# EAGLE design SirenaNextionNRF52 (EAGLE 9.6.2)
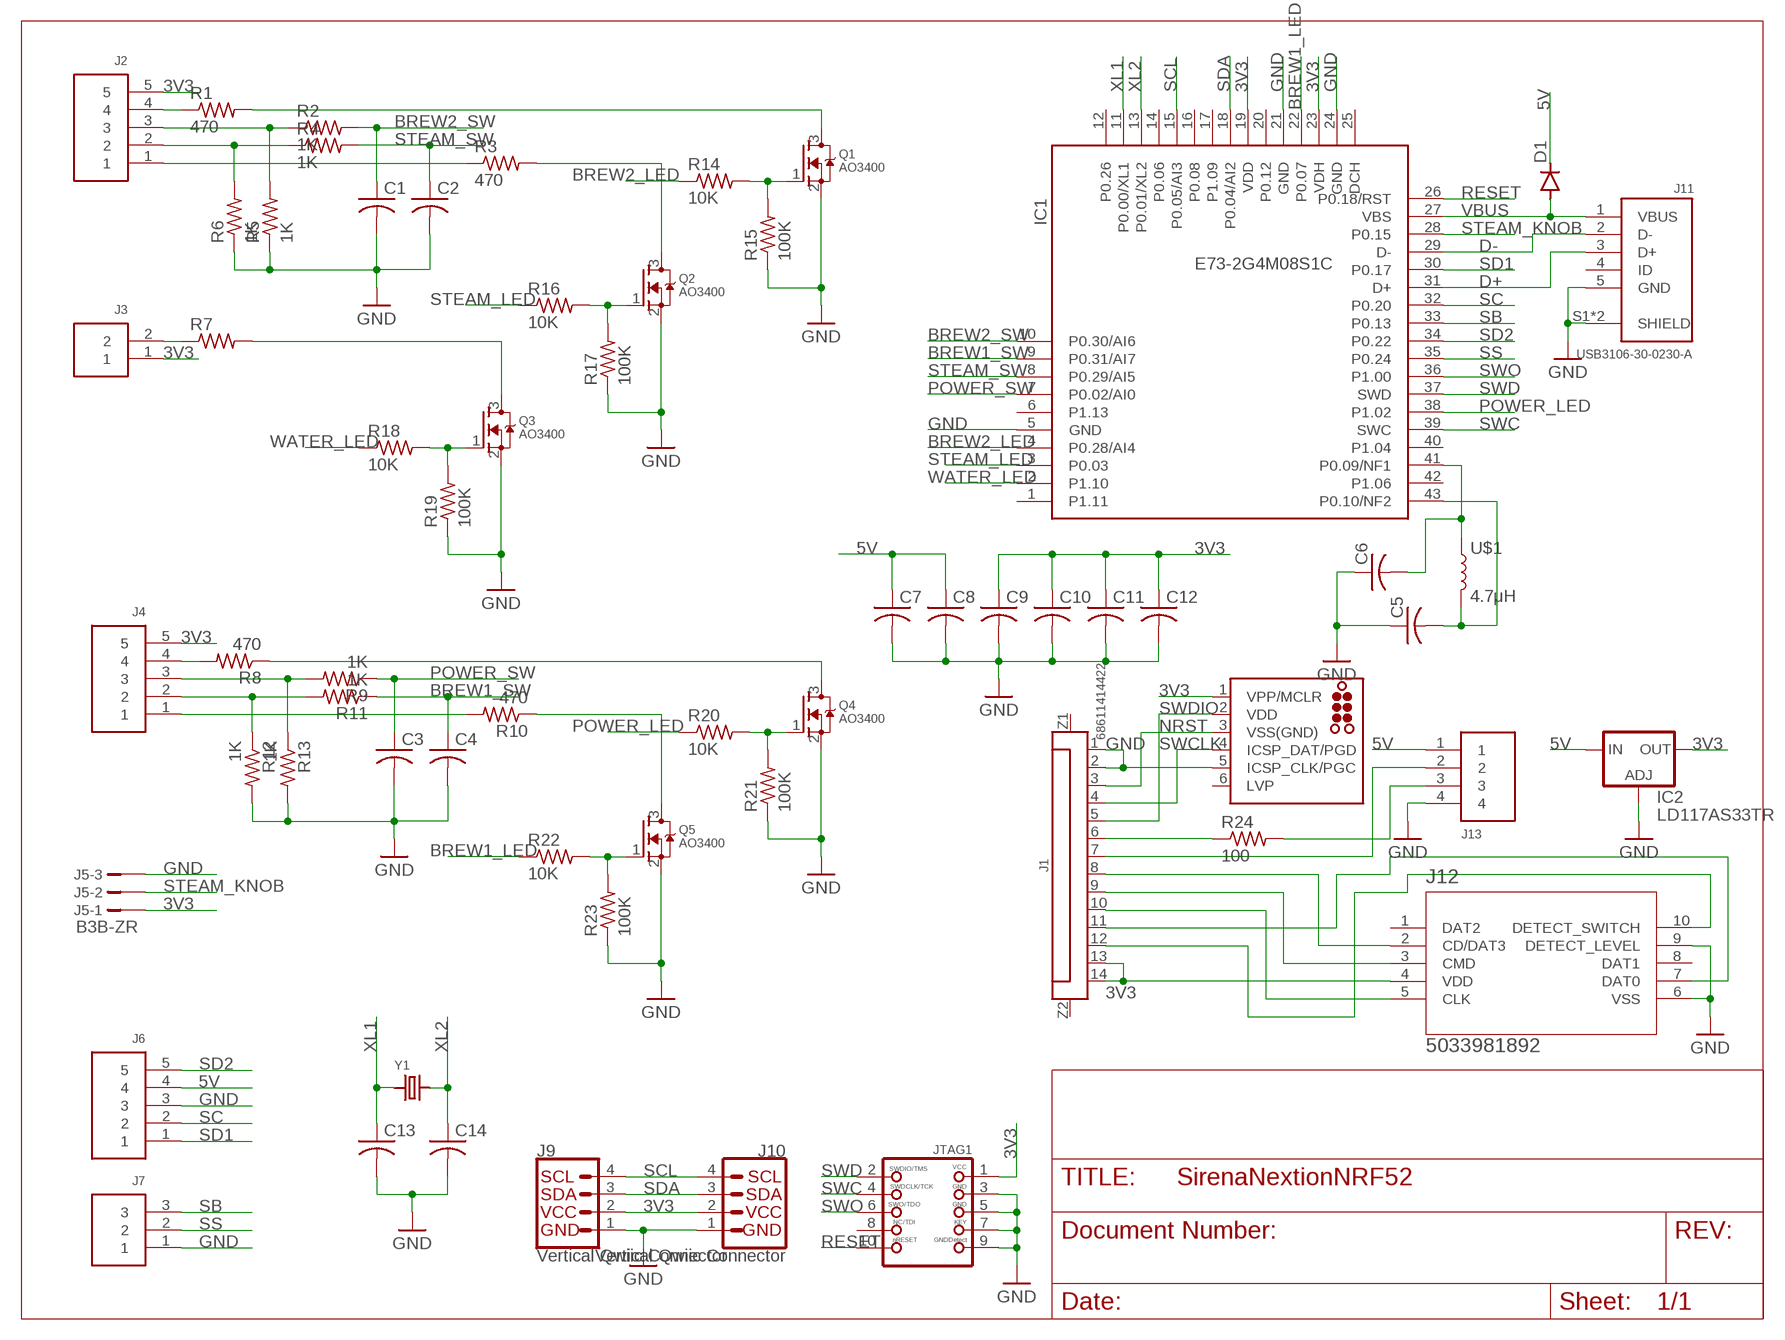
[diagram p0: schematic, sheet 1]

## Parts
C1  C-USC0603  [C0603]
C2  C-USC0603  [C0603]
C3  C-USC0603  [C0603]
C4  C-USC0603  [C0603]
C5  C-USC0603  [C0603]
C6  C-USC0603  [C0603]
C7  C-USC0603  [C0603]
C8  C-USC0603  [C0603]
C9  C-USC0603  [C0603]
C10  C-USC0603  [C0603]
C11  C-USC0603  [C0603]
C12  C-USC0603  [C0603]
C13  C-USC0603  [C0603]
C14  C-USC0603  [C0603]
D1  DIODE-SOD323-R  [SOD323-R]
IC1  E73-2G4M08S1C  [SMD]
IC2  LD117AS33TR  [SOT223]
J1  68611414422  6861XX14422_68611414422  [68611414422]
J2  5PINB5B-PH-SM4-TB  [B5B-PH-SM4-TB]
J3  2PINB2B-PH-SM4-TB  [B2B-PH-SM4-TB]
J4  5PINB5B-PH-SM4-TB  [B5B-PH-SM4-TB]
J5  B3B-ZR  [B3B-ZR]
J6  5PINB5B-PH-SM4-TB  [B5B-PH-SM4-TB]
J7  3PINB3B-PH-SM4-TB  [B3B-PH-SM4-TB]
J9  Vertical Qwiic Connector  QWIIC_CONNECTOR  [JST04_1MM_VERT]
J10  Vertical Qwiic Connector  QWIIC_CONNECTOR  [JST04_1MM_VERT]
J11  USB3106-30-0230-A  [USB3106-30-0230-A]
J12  5033981892  [503398-1892_MOL]
J13  4PIN  [B4B-XH-K-S]
J14  TC2030-MCP-NL  [TC2030-MCP-NL]
JTAG1  JTAG-CORTEXM3  [2X05_1.27MM_SMT]
Q1  AO3400  MOSFET-NREFLOW  [SOT23]
Q2  AO3400  MOSFET-NREFLOW  [SOT23]
Q3  AO3400  MOSFET-NREFLOW  [SOT23]
Q4  AO3400  MOSFET-NREFLOW  [SOT23]
Q5  AO3400  MOSFET-NREFLOW  [SOT23]
R1  470  R-US_R0603  [R0603]
R2  1K  R-US_R0603  [R0603]
R3  470  R-US_R0603  [R0603]
R4  1K  R-US_R0603  [R0603]
R5  1K  R-US_R0603  [R0603]
R6  1K  R-US_R0603  [R0603]
R7  R-US_R0603  [R0603]
R8  470  R-US_R0603  [R0603]
R9  1K  R-US_R0603  [R0603]
R10  470  R-US_R0603  [R0603]
R11  1K  R-US_R0603  [R0603]
R12  1K  R-US_R0603  [R0603]
R13  1K  R-US_R0603  [R0603]
R14  10K  R-US_R0603  [R0603]
R15  100K  R-US_R0603  [R0603]
R16  10K  R-US_R0603  [R0603]
R17  100K  R-US_R0603  [R0603]
R18  10K  R-US_R0603  [R0603]
R19  100K  R-US_R0603  [R0603]
R20  10K  R-US_R0603  [R0603]
R21  100K  R-US_R0603  [R0603]
R22  10K  R-US_R0603  [R0603]
R23  100K  R-US_R0603  [R0603]
R24  100  R-US_R0603  [R0603]
U$1  4.7μH  RFID_ANTENNA_W3102  [W3102]
Y1  CRYSTAL8X3.8SMT  [CRYSTAL_8X3.8]

## Nets
3V3: C9.1 C10.1 C11.1 C12.1 IC1.19(VDD) IC1.23(VDH) IC2.4(OUT) J1.13 J1.14 J2.5 J3.1 J4.5 J5.1 J9.2 J10.2 J12.4(VDD) J14.1(VPP/MCLR) JTAG1.1
5V: C7.1 C8.1 D1.C IC2.3(IN) J6.4 J13.1
BREW1_LED: IC1.22(P0.07) R22.1
BREW1_SW: C4.1 IC1.9(P0.31/AI7) R11.1
BREW2_LED: IC1.4(P0.28/AI4) R14.1
BREW2_SW: C1.1 IC1.10(P0.30/AI6) R2.2
D+: IC1.31(D+) J11.3(D+)
D-: IC1.29(D-) J11.2(D-)
GND: C1.2 C2.2 C3.2 C4.2 C5.1 C6.1 C7.2 C8.2 C9.2 C10.2 C11.2 C12.2 C13.2 C14.2 IC1.5(GND) IC1.21(GND) IC1.24(GND) IC2.1(ADJ) J1.1 J1.2 J5.3 J6.3 J7.1 J9.1 J10.1 J11.5(GND) J11.S1(SHIELD) J11.S2(SHIELD) J12.6(VSS) J12.9(DETECT_LEVEL) J13.4 J14.5(ICSP_CLK/PGC) JTAG1.3 JTAG1.5 JTAG1.7 JTAG1.9 Q1.2(S) Q2.2(S) Q3.2(S) Q4.2(S) Q5.2(S) R5.1 R6.1 R12.2 R13.2 R15.1 R17.1 R19.1 R21.1 R23.1
N$1: J3.2 R7.1
N$2: Q2.3(D) R3.2
N$4: J2.4 R1.1
N$5: J4.1 R10.2
N$6: J2.3 R2.1 R5.2
N$7: J2.2 R4.1 R6.2
N$8: Q1.3(D) R1.2
N$9: J1.8 J12.2(CD/DAT3)
N$10: J1.6 R24.1
N$11: C6.2 IC1.41(P0.09/NF1) U$1.1
N$12: Q2.1(G) R16.2 R17.2
N$13: Q1.1(G) R14.2 R15.2
N$14: C5.2 IC1.43(P0.10/NF2) U$1.2
N$16: Q3.3(D) R7.2
N$17: Q3.1(G) R18.2 R19.2
N$19: J4.4 R8.2
N$20: J4.3 R9.2 R13.1
N$21: J2.1 R3.1
N$22: J4.2 R11.2 R12.1
N$23: Q4.3(D) R8.1
N$24: Q5.3(D) R10.1
N$25: J13.3 R24.2
N$26: J1.7 J13.2
N$27: Q4.1(G) R20.2 R21.2
N$28: Q5.1(G) R22.2 R23.2
N$29: J1.9 J12.3(CMD)
N$30: J1.10 J12.5(CLK)
N$31: J1.11 J12.7(DAT0)
N$32: J1.12 J12.10(DETECT_SWITCH)
NRST: J1.3 J14.3(VSS(GND))
POWER_LED: IC1.38(P1.02) R20.1
POWER_SW: C3.1 IC1.7(P0.02/AI0) R9.1
RESET: IC1.26(P0.18/RST) JTAG1.10
SB: IC1.33(P0.13) J7.3
SC: IC1.32(P0.20) J6.2
SCL: IC1.15(P0.05/AI3) J9.4 J10.4
SD1: IC1.30(P0.17) J6.1
SD2: IC1.34(P0.22) J6.5
SDA: IC1.18(P0.04/AI2) J9.3 J10.3
SS: IC1.35(P0.24) J7.2
STEAM_KNOB: IC1.28(P0.15) J5.2
STEAM_LED: IC1.3(P0.03) R16.1
STEAM_SW: C2.1 IC1.8(P0.29/AI5) R4.2
SWC: IC1.39(SWC) JTAG1.4
SWCLK: J1.4 J14.4(ICSP_DAT/PGD)
SWD: IC1.37(SWD) JTAG1.2
SWDIO: J1.5 J14.2(VDD)
SWO: IC1.36(P1.00) JTAG1.6
VBUS: D1.A IC1.27(VBS) J11.1(VBUS)
WATER_LED: IC1.2(P1.10) R18.1
XL1: C13.1 IC1.11(P0.00/XL1) Y1.P$1
XL2: C14.1 IC1.13(P0.01/XL2) Y1.P$4
Unconnected: IC1.1(P1.11) IC1.6(P1.13) IC1.12(P0.26) IC1.14(P0.06) IC1.16(P0.08) IC1.17(P1.09) IC1.20(P0.12) IC1.25(DCH) IC1.40(P1.04) IC1.42(P1.06) J1.Z1 J1.Z2 J11.4(ID) J12.1(DAT2) J12.8(DAT1) J14.6(LVP) JTAG1.8

## Library data of the parts
C1-C14 = rcl:C-US: CAPACITOR, American symbol; SPICEPREFIX: C
D1 = diode:DIODE-: DIODE
IC1 = ebyte_E73:E73-2G4M08S1C: nRF52840 2.4GHz SMD Wireless Module
IC2 = v-reg:LD117A?*: Low drop fixed and adjustable positive voltage regulators 1 A Source: http://www.st.com/stonline/products/literature/ds/7194/ld1117axx.pdf
J1 = Wurth_Connectors_WR-FPC:6861XX14422_68611414422: WR-FPC 1.00 mm SMT ZIF Horizontal Bottom Contact KIND PROPERTIES Pitch 1 mm MATERIAL PROPERTIES Insulator Material PPS Contact Material Phosphor Bronze Contact Plating 100 (µ") Tin over 50 (µ") Nickel Contact Type Stamped <https://www.we-online.com/catalog/media/o33099v209%20Family_WR-FPC_68611214422.jpg> Details see: https://www.we-online.com/catalog/en/FPC_1_00_SMT_ZIF_HORIZONTAL_BOTTOM_CONTACT_6861XX14422/ Updated by Ella Wu 2021-07-19 2021(C) Wurth Elektronik; CONTACT-RESISTANCE: 20mOhm; DATASHEET-URL: https://www.we-online.com/catalog/datasheet/68611414422.pdf; IR: 1A; L: 21mm; MATE-WITH: WR-FFC 1.00 mm Flat Flexible Cable Type 1 (Contacts on same side)/ Type 2 (Contacts opposite); PACKAGING: Tape and Reel; PART-NUMBER: 68611414422; PINS: 14; PITCH: 1mm; TYPE: Horizontal; WORKING-VOLTAGE: 125V(AC)
J2 J4 J6 = jst_eph:5PIN
J3 = jst_eph:2PIN
J5 = con-jst (2):?3B-ZR: ZH CONNECTOR 1.5 mm, 3 pin 1 row Source: http://www.jst.com .. eZH.pdf
J7 = jst_eph:3PIN
J9 J10 = SparkFun-Connectors:QWIIC_CONNECTOR: SparkFun I2C Standard Qwiic Connector An SMD 1mm pitch JST connector makes it easy and quick (get it? Qwiic?) to connect I2C devices to each other. The Qwiic system <http://www.sparkfun.com/qwiic> enables fast and solderless connection between popular platforms and various sensors and actuators. We carry 200mm <https://www.sparkfun.com/products/14204>, 100mm <https://www.sparkfun.com/products/14205>, 50mm <https://www.sparkfun.com/products/14206>, and breadboard friendly <https://www.sparkfun.com/products/14207> Qwiic cables. We also offer 10 pcs strips <https://www.sparkfun.com/products/14323> the SMD connectors.; PROD_ID: CONN-14483
J11 = USB connector:USB3106-30-0230-A: MICRO A/B SKT, VERTICAL, TH, 30" Manufacturer's datasheet <https://gct.co/files/drawings/usb3106.pdf>; CREATED_BY: PCBLayout.com; DIGIKEY_PARTNO: 2073-USB3106-30-0230-ATR-ND; MANUFACTURER: GCT; MPN: USB3106-30-0230-A
J12 = discrete:5033981892: MOLEX 503398-1892 MEMORY CARD SOCKET; COPYRIGHT: Copyright (C) 2022 Ultra Librarian. All rights reserved.; MANUFACTURER_PART_NUMBER: 5033981892; MFR_NAME: Molex Connector Corporation
J13 = jst_exh:4PIN
J14 = tag-connect:TC2030: TAG-CONNECT ICSP Connector Manufacturer: Tag-Connect <http://www.tag-connect.com> Cable for easy In-Circuit Serial Programming. Designed for Microchip ICD2, suitable for many others. Two variants - one "with legs" (for hands-free fit on PCB) and another "without legs" for quick programming. PAD Description 1 MCLR/Vpp 2 Vdd 3 GND 4 PGD (ISPDAT) 5 PGC (ISPCLK) 6 nc (used for LVP) ©2009 ROFA.cz - modified and updated by Robert Darlington ‹rdarlington@gmail.com›
JTAG1 = microbuilder:JTAG-CORTEXM3: Serial Wire (SW-DP) Connector This standard 0.05" 10-pin connector is for use with the Cortex M0/M3's native SWD (serial wire debugger) interface (SW-DP). Some boards support a 20-pin combined JTAG+SWD connector (SWJ-DP), such as the LPC1700 family, but many smaller devices only work with SWD which typically use the smaller 10-pin SW-DP connecter (the LPC1300 family, for example, only supports SWD). 2x05 1.27mm/0.05" Connector: This is the standard SMT connector defined by ARM for all Cortex devices, and should be used in most situations and for forward-compatibility since any new devices coming to market will likely use this connector. MOLEX 10 Pin 0.1" Connector: This 0.1" 10 pin connector has the same pin layout as the standard 0.05" connector, but is easier to work with if you are using standard jumper wires or custom cables to connect your SWD hardware. MOLEX 20 Pin 0.1" Connector: This 0.1" 20 pin connector is the same model used for ARM7/ARM9 JTAG debuggers, but is connected to match the pins on the Segger J-Link for ARM (which supports both JTAG and SWD debugging). See the following document from ARM for more information on Cortex M3 Debug Connectors: http://infocenter.arm.com/help/topic/com.arm.doc.faqs/attached/13634/cortex_debug_connectors.pdf And the following page for an overview with images of the different connector types: http://www.keil.com/peripherals/coresight/connectors.asp
Q1-Q5 = adafruit:MOSFET-N: N-Channel Mosfet 2N7002E - 60V 260mA SOT23 [Digikey: 2N7002ET1GOSTR-ND] - REEL BSH103 - 30V 850mA SOT23 [Digikey: 568-5013-1-ND]
R1-R24 = rcl:R-US_: RESISTOR, American symbol; SPICEPREFIX: R
U$1 = SparkFun-RF:RFID_ANTENNA_W3102: W3102 Pulse Larsen NFC / RFID SMD Antenna 13.56MHz 4.7μH; PROD_ID: ANT-16333
Y1 = microbuilder:CRYSTAL: Crystals HC49UP - Surface Mount Crystal 4.0MHz 18pF +/-30ppm Surface Mount Crystal [Digikey: 535-9857-1-ND] 12.0 MHz Surface Mount Crystal [Digikey: 535-9869-6-ND] 25.0 MHz Surface Mount Crystal [Digikey: 535-9078-1-ND] 2.5 x 2.0mm - MEMs SMT Crystal 16.0 MHz 10pF 20ppm 2.5 x 2.0mm Crystal [Digikey -40-85°C: 535-10923-1-ND] 3.2 x 2.5mm - MEMs SMT Crystal 12.0 MHz 8pF 15ppm 3.2 x 2.5mm Crystal [Digikey: -10-70°C: 644-1047-1-ND -40-125°C: 644-1128-1-ND] 16.0 MHz 8pF 15ppm 3.2 x 2.5mm Crystal [Digikey: -10-70°C: 644-1049-1-ND -40-125°C: 644-1129-2-ND] 16.0 MHz 10pF 10ppm 3.2 x 2.5mm Crystal [Digikey: 644-1100-1-ND] 27.12 MHz 18pF 30ppm 3.2 x 2.5mm Crystal [Digikey: 887-1424-1-ND] 27.12MHz 10pF 10ppm 3.2 x 2.5mm Crystal [Digikey: 887-1329-1-ND] 4.9 x 1.8mm - MEMs SMT Crystal 32.768 KHz 12.5pF 20ppm 4.9 x 1.8mm Crystal [Digikey: SE2415CT-ND] 8.0 x 3.8mm - Surface Mount Crystal 32.768kHz 12.5pF 20ppm -40°C-85°C [Digikey: 535-9166-2-ND] Cylinder 32.768KHz Cylinder Crystal (2x6mm body) [Ex. Digikey: 300-8341-2-ND]

## Board
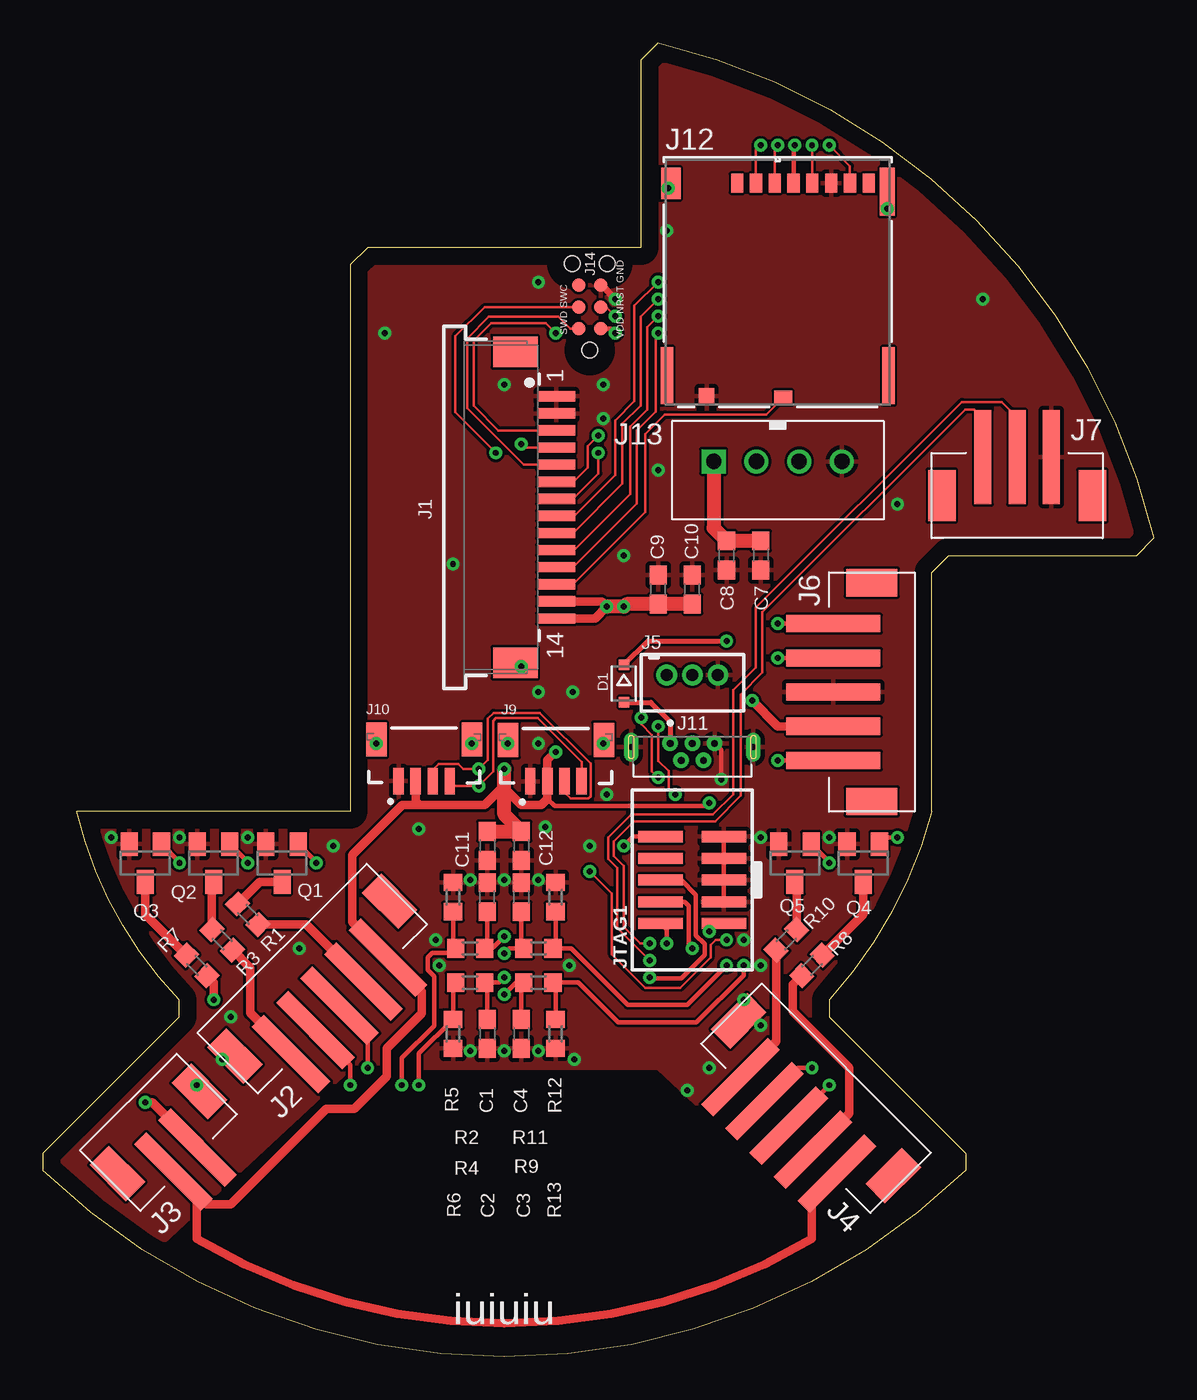
[diagram p1: board, top side]
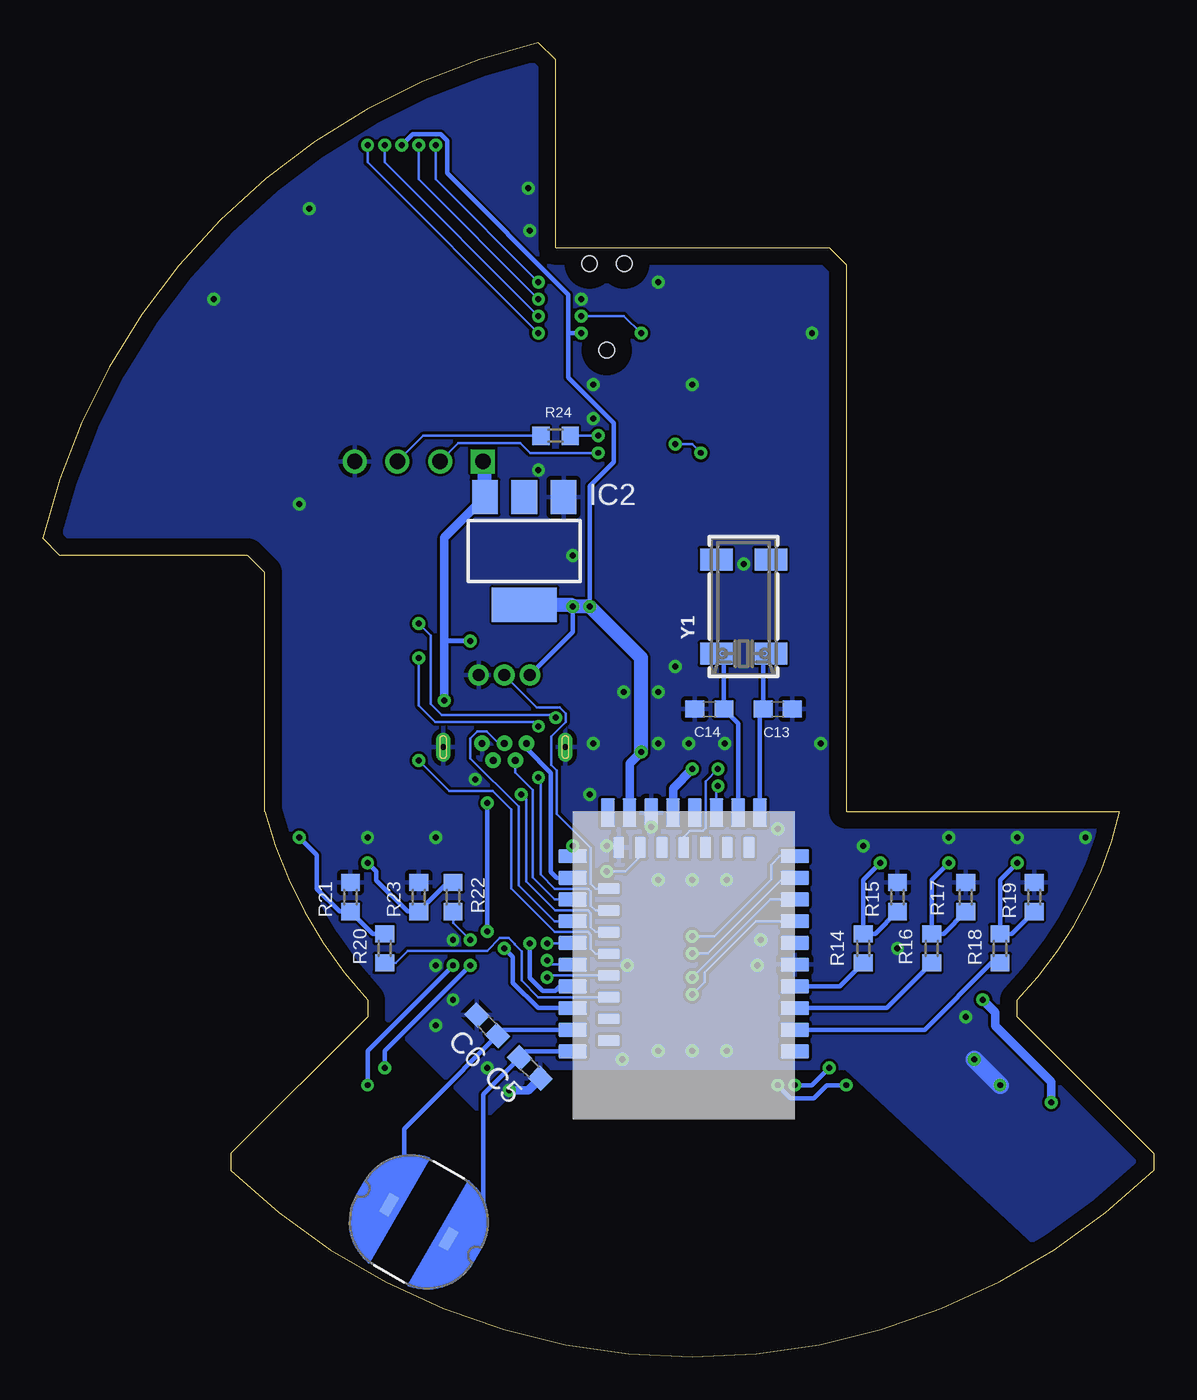
[diagram p2: board, bottom side, seen from below]

Size 65 x 76.9 mm. Coordinates in mm from the lower left corner, seen from the top.
Outline: 35,64.9 35,75.9 36,76.9 arc-63 65,47.9 64,46.9 53,46.9 52,45.9 52,31.9 arc-28 46,20.9 46,19.9 54,11.9 54,10.9 arc-88 0,10.9 0,11.9 8,19.9 8,20.9 arc-31 2,31.9 18,31.9 18,63.9 19,64.9 35,64.9
Copper layers (1*16): Top 0.035mm / dielectric 1.5mm / Bottom 0.035mm
Design rules "default *": minimum track width 6mil, minimum drill 0.35mm, track to track 6mil, track to pad 6mil, pad to pad 6mil, via to via 6mil, smd to smd 6mil, copper to edge 40mil, drill to drill 6mil, minimum pad ring 10mil, minimum via ring 8mil, stop-mask expansion 2mil, vias tented up to drill 100mil, thermal gap 10mil

### Footprints (pad centres in the part's own frame; a part is rotated, then mirrored left to right if it is on the bottom)
C0603 = smd 1.1 x 1: 1 -0.85,0; 2 0.85,0
SOD323-R = smd 0.6 x 0.6: A 1.1,0; C -1.1,0
SMD = smd 1.676 x 0.813: 1 13,3.97; 2 13,5.24; 3 13,6.51; 4 13,7.78; 5 13,9.05; 6 13,10.32; 7 13,11.59; 8 13,12.86; 9 13,14.13; 10 13,15.4; 26 0,15.4; 27 0,14.13; 29 0,12.86; 31 0,11.59; 33 0,10.32; 35 0,9.05; 37 0,7.78; 39 0,6.51; 41 0,5.24; 43 0,3.97 | smd 0.813 x 1.676: 11 10.95,17.94; 13 9.68,17.94; 15 8.41,17.94; 17 7.14,17.94; 19 5.87,17.94; 21 4.6,17.94; 23 3.33,17.94; 25 2.06,17.94 | smd 0.635 x 1.27: 12 10.31,15.9; 14 9.04,15.9; 16 7.77,15.9; 18 6.5,15.9; 20 5.23,15.9; 22 3.96,15.9; 24 2.69,15.9 | smd 1.27 x 0.635: 28 2.1,13.495; 30 2.1,12.225; 32 2.1,10.955; 34 2.1,9.685; 36 2.1,8.415; 38 2.1,7.145; 40 2.1,5.875; 42 2.1,4.605
SOT223 = smd 1.5 x 2: 1 -2.3,-3.15; 2 0,-3.15; 3 2.3,-3.15 | smd 3.8 x 2: 4 0,3.15
68611414422 = smd 0.6 x 2.2: 1 -6.5,3.8; 2 -5.5,3.8; 3 -4.5,3.8; 4 -3.5,3.8; 5 -2.5,3.8; 6 -1.5,3.8; 7 -0.5,3.8; 8 0.5,3.8; 9 1.5,3.8; 10 2.5,3.8; 11 3.5,3.8; 12 4.5,3.8; 13 5.5,3.8; 14 6.5,3.8 | smd 1.8 x 2.6: Z1 -9.1,1.4; Z2 9.1,1.4
B5B-PH-SM4-TB = smd 1 x 5.5: 1 -4,-4.75; 2 -2,-4.75; 3 0,-4.75; 4 2,-4.75; 5 4,-4.75 | smd 1.6 x 3: P1 -6.4,-2.5; P2 6.4,-2.5
B2B-PH-SM4-TB = smd 1 x 5.5: 1 -1,-4.75; 2 1,-4.75 | smd 1.6 x 3: P1 -3.4,-2.5; P2 3.4,-2.5
B3B-ZR = drill 0.7 pad 1.1: 1 -1.5,0; 2 0,0; 3 1.5,0
B3B-PH-SM4-TB = smd 1 x 5.5: 1 -2,-4.75; 2 0,-4.75; 3 2,-4.75 | smd 1.6 x 3: P1 -4.4,-2.5; P2 4.4,-2.5
JST04_1MM_VERT = smd 0.6 x 1.55: 1 -1.478,0.775; 2 -0.478,0.775; 3 0.522,0.775; 4 1.522,0.775 | smd 1.2 x 2: NC1 -2.778,3.2; NC2 2.822,3.2
USB3106-30-0230-A = drill 0.4: 1 -1.3,0; 2 -0.65,-1; 3 0,0; 4 0.65,-1; 5 1.3,0 | drill 0.35 long: S1 -3.575,-0.22; S2 3.575,-0.22
503398-1892_MOL = smd 0.711 x 1.092: 1 -2.38,5.776; 2 -1.28,5.776; 3 -0.18,5.776; 4 0.92,5.776; 5 2.02,5.776; 6 3.12,5.776; 7 4.22,5.776; 8 5.32,5.776 | smd 0.889 x 0.94: 9 -4.17,-6.689 | smd 1.041 x 0.787: 10 0.31,-6.764 | smd 1.143 x 1.829: 11 -6.26,5.761 | smd 0.864 x 2.794: 12 6.4,5.276 | smd 0.711 x 3.327: 13 -6.48,-5.489; 14 6.48,-5.489
B4B-XH-K-S = drill 0.9 square: 1 3.75,0 | drill 0.9: 2 1.25,0; 3 -1.25,0; 4 -3.75,0
TC2030-MCP-NL = smd 0.787 x 0.787: 1 1.27,-0.635; 2 1.27,0.635; 3 2.54,-0.635; 4 2.54,0.635; 5 3.81,-0.635; 6 3.81,0.635 | hole 0.889: 0,0; 5.08,-1.016; 5.08,1.016
2X05_1.27MM_SMT = smd 0.65 x 2.6: 1 -2.54,-1.85; 2 -2.54,1.85; 3 -1.27,-1.85; 4 -1.27,1.85; 5 0,-1.85; 6 0,1.85; 7 1.27,-1.85; 8 1.27,1.85; 9 2.54,-1.85; 10 2.54,1.85
SOT23 = smd 1 x 1.4: 1 -0.95,-1.1; 2 0.95,-1.1; 3 0,1.1
R0603 = smd 1 x 1.1: 1 -0.85,0; 2 0.85,0
W3102 = smd 1.27 x 0.635: 1 0,2; 2 0,-2
CRYSTAL_8X3.8 = smd 1.3 x 1.9: P$1 -2.75,-1.6; P$2 2.75,-1.6; P$3 2.75,1.6; P$4 -2.75,1.6

### Placement (x,y rotation side)
C1  26,26.9 90 top
C2  26,18.9 270 top
C3  28,18.9 270 top
C4  28,26.9 90 top
C5  36.5,16.9 135 bottom
C6  39,19.4 315 bottom
C7  42,46.9 270 top
C8  40,46.9 270 top
C9  36,44.9 90 top
C10  38,44.9 90 top
C11  26,29.9 270 top
C12  28,29.9 270 top
C13  22,37.9 0 bottom
C14  26,37.9 180 bottom
D1  34,39.4 270 top
IC1  34,13.9 0 bottom
IC2  36.83,47.16 180 bottom
J1  26.25,49.71 270 top
J2  14,23.9 45 top
J3  5,14.9 45 top
J4  47,16.9 315 top
J5  38,39.9 0 top
J6  51,38.9 270 top
J7  57,47.9 180 top
J9  30,32.9 0 top
J10  22.29,32.92 0 top
J11  38,35.9 0 top
J12  43,62.9 0 top
J13  43,52.4 180 top
J14  32,58.9 90 top
JTAG1  38,27.9 90 top
Q1  14,28.9 180 top
Q2  10,28.9 180 top
Q3  6,28.9 180 top
Q4  48,28.9 180 top
Q5  44,28.9 180 top
R1  12,25.9 135 top
R2  25,23.9 0 top
R3  10.5,24.4 135 top
R4  25,21.9 0 top
R5  24,26.9 270 top
R6  24,18.9 90 top
R7  9,22.9 135 top
R8  45,22.9 225 top
R9  29,21.9 0 top
R10  43.5,24.4 225 top
R11  29,23.9 0 top
R12  30,26.9 90 top
R13  30,18.9 270 top
R14  17,23.9 90 bottom
R15  15,26.9 270 bottom
R16  13,23.9 90 bottom
R17  11,26.9 270 bottom
R18  9,23.9 90 bottom
R19  7,26.9 270 bottom
R20  45,23.9 90 bottom
R21  47,26.9 270 bottom
R22  41,26.9 90 bottom
R23  43,26.9 270 bottom
R24  35,53.9 180 bottom
U$1  43,7.9 60 bottom
Y1  24,43.9 90 bottom

### Tracks (layer width: path | path; a pad name or v marks a point on that pad's centre or on a via)
3V3  (via drill 0.35)
  Top 0.254: J12.4 43.92,70.82 v44,70.9 | v39,24.9 39.46,25.36 JTAG1.1 | v39,32.4 38.84,32.24 29.94,32.24 29.52,32.66 | J14.1 33.23,60.17 v33.5,59.9
  Top 0.508: J10.2 21.81,32.51 22.04,32.28 | 22.04,32.28 25.85,32.28 27,33.44 v27,34.4 27,33.29 28.01,32.28 29.15,32.28 29.52,32.66 J9.2 29.52,34.92 v30,35.4 | J1.13 32.69,44.21 v33,43.9 32.31,43.21 J1.14 | J3.1 9,9.48 | 9,9.48 9,6.9 arc61 45,6.9 45,9.24 J4.5 | 9,9.48 9.57,8.91 10.99,8.91 16.57,14.5 18.23,14.5 20.13,16.41 20.13,18.06 22.16,20.09 22.16,21.39 J2.5 18.1,25.46 18.1,29.36 21.02,32.28 22.04,32.28
  Top 0.813: v33,43.9 v34,43.9 34.15,44.05 C9.1 C10.1 | C11.1 C12.1 27,31.75 v27,34.4
  Bottom 0.254: v33,43.9 33,50.96 31.59,52.37 31.59,54.63 34.26,57.3 34.26,59.84 | 34.26,59.84 34.26,62.17 41.34,69.26 41.34,71.17 41.73,71.56 43.34,71.56 v44,70.9 | J5.1 34,42.4 v34,43.9 | v39,32.4 v39,24.9 | v33.5,59.9 34.2,59.9 34.26,59.84
  Bottom 0.508: IC1.19 28.13,33.27 v27,34.4 | IC1.23 30.67,34.73 v30,35.4
  Bottom 0.813: IC2.4 34.11,44.01 v34,43.9 v33,43.9 30,40.9 v30,35.4
5V  (via drill 0.35)
  Top 0.305: D1.C 35.4,41.9 v40,41.9
  Top 0.508: J6.4 43,36.9 v41.5,38.4
  Top 0.813: C7.1 C8.1 39.25,48.5 J13.1
  Bottom 0.305: v40,41.9 41.46,41.9 41.5,41.93
  Bottom 0.508: v41.5,38.4 41.5,41.93 41.5,47.94 IC2.3
  Bottom 0.813: IC2.3 39.13,52.28 J13.1
BREW1_LED  (via drill 0.35)
  Top 0.152: v32,28.4 33.29,27.11 33.29,23.55 35.25,21.59 37.3,21.59 39.07,23.36 39.07,24.1 39.37,24.4 v40,24.4
  Bottom 0.152: R22.1 41,25.4 v40,24.4 | IC1.22 30.04,29.29 30.93,28.4 v32,28.4
BREW1_SW  (via drill 0.35)
  Top 0.254: C4.1 28,24.05 R11.1 27.3,23.9 v27,23.6
  Bottom 0.152: IC1.9 21.68,28.03 26.11,23.6 v27,23.6
BREW2_LED
  Bottom 0.254: IC1.4 18.37,21.68 R14.1
BREW2_SW  (via drill 0.35)
  Top 0.254: C1.1 26,24.05 R2.2 25.85,23.96 26.37,23.96 v27,24.6
  Bottom 0.152: v27,24.6 25.73,24.6 22.4,27.93 22.4,28.79 21.89,29.3 IC1.10
D+
  Bottom 0.152: J11.3 38.34,35.9 39.02,36.58 39.58,36.58 39.98,36.18 39.98,35.01 37.16,32.19 37.16,27.6 35.05,25.49 IC1.31
D-
  Bottom 0.152: J11.2 37.35,34.19 36.33,33.17 36.33,28.04 35.05,26.76 IC1.29
GND  (via drill 0.35)
  Top 0.254: JTAG1.3 JTAG1.5 JTAG1.7 JTAG1.9 | J11.5 39.7,35.5 v39.7,33.8
  Top 0.406: J14.5 32.69,62.71 v33.5,61.9
  Bottom 0.508: C5.1 36.6,15.6 v37.7,15.6
  Bottom 1.016: v9,15.9 v10.5,17.4
  other vias: 12,30.4 8,30.4 4,30.4 42,30.4 46,30.4 25,17.9 27,17.9 29,17.9 25,27.9 27,27.9 29,27.9 15,23.9 11,19.9 41,20.9 39,16.9 28,40.4 36.6,68.4 49.4,67.2 31.1,17.4 23,24.4 17,29.9 22,30.9 19.5,35.9 25.1,35.9 27.2,35.9 32.8,35.9 42,19.4 32.8,56.9 34,46.9 50,49.9 29,35.9 33,32.9 20,59.9 29,38.9 31,38.9 29.4,31 27,56.9 24,46.4 55,61.9 42,22.9 23.2,22.9 30.8,22.9 41,24.4 32,29.9 29,62.9 36.5,65.9 32.8,54.9 36,51.9
  pour Top: 4,3.9 18,16.9 36,16.9 39.11,14.01 66,40.9 66,57.9 46,77.9 8,77.9 -12,57.9 -12,19.9
  pour Bottom: 4,3.9 18,16.9 36,16.9 39.11,14.01 66,40.9 66,57.9 46,77.9 8,77.9 -12,57.9 -12,19.9
N$1  (via drill 0.35)
  Top 0.508: v10,20.9 10,21.9 R7.1 | J3.2 6.41,14.9 v6,14.9
  Bottom 0.508: v6,14.9 6,16.1 9.27,19.37 9.27,20.17 v10,20.9
N$2
  Top 0.508: R3.2 9.9,27.7 Q2.3
N$4
  Top 0.508: R1.1 15.43,25.3 J2.4
N$5
  Top 0.508: R10.2 42.9,18.45 J4.1
N$6  (via drill 0.35)
  Top 0.254: R5.2 24,24.05 R2.1 23.9,23.64 22.8,23.64 22.51,23.36 22.51,22.63 22.89,22.25 22.89,19.37 21,17.48 v21,15.9 | v19,16.9 19,18.9 J2.3
  Bottom 0.254: v19,16.9 20,15.9 v21,15.9
N$7  (via drill 0.35)
  Top 0.254: R4.1 24,21.75 R6.2 22,17.75 v22,15.9 | v18,15.9 18,17.07 J2.2
  Bottom 0.254: v22,15.9 21.24,15.14 19.91,15.14 19.14,15.9 v18,15.9
N$8
  Top 0.508: R1.2 12.7,27.8 Q1.3
N$9  (via drill 0.35)
  Top 0.152: v36,62.9 34.6,61.5 34.6,55.91 33.48,54.79 33.48,51.6 31.09,49.21 J1.8 | J12.2 41.72,70.62 v42,70.9
  Bottom 0.152: v36,62.9 42,68.9 v42,70.9
N$10  (via drill 0.35)
  Top 0.152: J1.6 31.05,51.21 31.89,52.05 31.89,53.29 v32.5,53.9
  Bottom 0.152: v32.5,53.9 R24.1
N$11
  Bottom 0.254: IC1.41 38.06,19.14 C6.2 42.33,14.86 43.84,13.35 43.84,9.79 U$1.1
N$12  (via drill 0.35)
  Top 0.254: Q2.1 12,28.95 v12,28.9
  Bottom 0.254: v12,28.9 13,27.9 R16.2 12.3,24.75 R17.2
N$13  (via drill 0.35)
  Top 0.254: Q1.1 16,28.95 v16,28.9
  Bottom 0.254: v16,28.9 17,27.9 R14.2 16.3,24.75 R15.2
N$14
  Bottom 0.254: IC1.43 36.73,17.87 C5.2 39.24,15.36 39.24,8.93 U$1.2
N$16
  Top 0.508: Q3.3 6,25.9 R7.2
N$17  (via drill 0.35)
  Top 0.254: Q3.1 8,28.95 v8,28.9
  Bottom 0.254: v8,28.9 9,27.9 R18.2 8.3,24.75 R19.2
N$19
  Top 0.508: R8.2 43.88,21.78 43.88,20.22 47.18,16.92 47.18,14.25 J4.4
N$20  (via drill 0.35)
  Top 0.254: R13.1 30,21.75 R9.2 31.33,21.9 33.66,19.56 38.23,19.56 41,22.33 v41,22.9 | J4.3 v46,15.9
  Bottom 0.254: v46,15.9 46,17.9 v41,22.9
N$21
  Top 0.508: J2.1 12.13,20.11 12.13,22.77 R3.1
N$22  (via drill 0.35)
  Top 0.254: R12.1 30,24.05 R11.2 30.92,23.9 34.21,20.6 37.71,20.6 v40,22.9 | J4.2 44.17,16.9 v45,16.9
  Bottom 0.254: v45,16.9 45,17.9 v40,22.9
N$23
  Top 0.508: R8.1 48,25.9 Q4.3
N$24
  Top 0.508: R10.1 44.1,27.7 Q5.3
N$25
  Bottom 0.152: R24.2 42.75,53.9 J13.3
N$26  (via drill 0.35)
  Top 0.152: J1.7 31.02,50.21 32.5,51.69 v32.5,52.9
  Bottom 0.152: v32.5,52.9 36.49,52.9 37.05,53.46 40.69,53.46 J13.2
N$27  (via drill 0.35)
  Top 0.254: Q4.1 49.35,30.4 v50,30.4
  Bottom 0.254: v50,30.4 48.97,29.37 48.97,27.39 47.63,26.05 R21.2 45.7,24.75 R20.2
N$28  (via drill 0.35)
  Top 0.254: Q5.1 46,28.95 v46,28.9
  Bottom 0.254: R22.2 41.3,27.75 R23.2 43.66,26.05 45.49,27.88 45.49,28.39 v46,28.9
N$29  (via drill 0.35)
  Top 0.152: J1.9 31.03,48.21 33.91,51.09 33.91,54.6 34.98,55.67 34.98,60.88 v36,61.9 | J12.3 42.82,70.72 v43,70.9
  Bottom 0.152: v36,61.9 43,68.9 v43,70.9
N$30  (via drill 0.35)
  Top 0.152: J1.10 31.09,47.21 34.35,50.47 34.35,54.43 35.37,55.44 35.37,60.26 v36,60.9 | J12.5 45.02,70.88 v45,70.9
  Bottom 0.152: v36,60.9 45,69.9 v45,70.9
N$31  (via drill 0.35)
  Top 0.152: J1.11 31.03,46.21 34.75,49.93 34.75,54.2 35.87,55.33 35.87,59.77 v36,59.9 | J12.7 47.22,69.68 v46,70.9
  Bottom 0.152: v36,59.9 46,69.9 v46,70.9
N$32
  Top 0.152: J1.12 31.03,45.21 35.24,49.42 35.24,54 36.39,55.14 42.32,55.14 J12.10
NRST  (via drill 0.35)
  Top 0.152: v33.5,60.9 32.96,61.44 J14.3 | J1.3 26.65,54.21 25.21,55.65 25.21,59.46 26.23,60.48 29.42,60.48 v30,59.9
  Bottom 0.152: v30,59.9 31,60.9 v33.5,60.9
POWER_LED
  Bottom 0.152: IC1.38 36,21.04 36.98,22.02 36.98,23.73 37.39,24.14 37.39,24.15 37.75,24.5 38.25,24.5 39,23.76 43.65,23.76 44.36,23.05 R20.1
POWER_SW  (via drill 0.35)
  Top 0.254: C3.1 28,21.75 R9.1 27.7,21.9 v27,21.2
  Bottom 0.152: v27,21.2 26.27,21.92 26.27,22.49 23.28,25.49 IC1.7
RESET  (via drill 0.35)
  Top 0.254: JTAG1.10 34.54,30.44 v34,29.9
  Bottom 0.254: IC1.26 v34,29.9
SB  (via drill 0.35)
  Top 0.152: v35.5,24.2 34.95,24.2 33.98,25.17 33.98,28.72 33.39,29.31 33.39,30.15 34.58,31.34 39.33,31.34 40.83,32.84 40.83,38.76 42.1,40.03 42.1,43.59 53.96,55.44 54.49,55.44 55,54.93 J7.3
  Bottom 0.152: v35.5,24.2 34.02,24.2 IC1.33
SC  (via drill 0.35)
  Top 0.152: v37,32.9 36.61,33.29 36.61,34.27 36,34.87 v36,36.9
  Top 0.254: v43,40.9 J6.2
  Bottom 0.152: v43,40.9 43,38.11 42.05,37.16 36.26,37.16 v36,36.9 | IC1.32 32.66,24.85 32.93,25.12 32.93,25.95 33.1,26.12 35.02,26.12 36.73,27.83 36.73,32.63 v37,32.9
SCL  (via drill 0.35)
  Top 0.152: J10.4 24.11,33.4 v25.5,33.4 26.34,34.24 26.34,37.21 26.51,37.38 28.95,37.38 31.52,34.81 J9.4
  Bottom 0.152: IC1.15 25.59,33.31 v25.5,33.4
SD1  (via drill 0.35)
  Top 0.152: v36,33.9 35.63,34.26 35.63,36.38 35,37.02 v35,37.4
  Top 0.254: J6.1 v43,42.9
  Bottom 0.152: v43,42.9 42.31,42.21 42.31,38.21 41.67,37.57 35.17,37.57 v35,37.4 | IC1.30 32.66,26.12 32.93,26.39 32.93,27.22 33.1,27.39 35.05,27.39 35.87,28.22 35.87,33.77 v36,33.9
SD2  (via drill 0.35)
  Top 0.254: v43,34.9 J6.5
  Bottom 0.152: v43,34.9 41.22,33.12 38.68,33.12 37.59,32.03 37.59,27.4 35.05,24.85 33.1,24.85 32.93,24.68 32.93,23.85 32.66,23.58 IC1.34
SDA  (via drill 0.35)
  Top 0.152: J10.3 22.81,34.33 23.18,34.7 24.31,34.7 24.61,34.4 v25.5,34.4 26.04,34.94 26.04,37.34 26.38,37.68 29.08,37.68 32.05,34.71 32.05,32.8 31.92,32.67 30.87,32.67 30.52,33.02 J9.3
  Bottom 0.152: IC1.18 27.5,30.43 27.16,30.77 26.4,30.77 26.23,30.94 26.23,33.67 v25.5,34.4
SS  (via drill 0.35)
  Top 0.152: v35.5,23.2 33.59,25.1 33.59,28.61 33.09,29.12 33.09,30.38 34.44,31.73 39.21,31.73 40.4,32.92 40.4,39.01 41.72,40.33 41.72,43.84 53.76,55.88 56.1,55.88 57,54.98 J7.2
  Bottom 0.152: v35.5,23.2 35.25,22.95 IC1.35
STEAM_KNOB
  Bottom 0.152: J5.2 36.11,38 34.75,38 34.39,37.65 34.39,37.15 35.24,36.3 35.24,34.64 34.92,34.32 34.92,31.75 32.93,29.76 32.93,27.66 32.66,27.39 IC1.28
STEAM_LED
  Bottom 0.254: R16.1 15.64,20.41 IC1.3
STEAM_SW  (via drill 0.35)
  Top 0.254: C2.1 26,21.75 R4.2 26.7,21.9 v27,22.2
  Bottom 0.152: IC1.8 22.44,26.76 v27,22.2
SWC  (via drill 0.35)
  Top 0.254: v38,23.9 37.8,24.1 37.8,26.37 37.55,26.63 JTAG1.4
  Bottom 0.254: IC1.39 36.01,20.41 37.49,21.89 37.49,23.39 v38,23.9
SWCLK  (via drill 0.35)
  Top 0.152: J1.4 28.19,53.21 v28,53.4 | v26.5,52.9 26.5,52.91 24.14,55.27 24.14,59.71 25.87,61.44 J14.4
  Bottom 0.152: v26.5,52.9 27,53.4 v28,53.4
SWD  (via drill 0.35)
  Top 0.254: v36.5,24.2 36.5,25.01 JTAG1.2
  Bottom 0.254: IC1.37 34.76,21.68 35.02,21.42 35.75,21.42 36.5,22.17 v36.5,24.2
SWDIO
  Top 0.152: J14.2 30.85,60.17 30.16,60.86 26.1,60.86 24.83,59.59 24.83,55.52 28.15,52.21 J1.5
SWO  (via drill 0.35)
  Top 0.254: JTAG1.6 37.34,27.9 38.21,27.03 38.21,24.66 38.72,24.15 38.72,23.51 37.35,22.14 35.55,22.14 v35.5,22.2
  Bottom 0.152: IC1.36 35.38,22.31 v35.5,22.2
VBUS
  Top 0.305: D1.A 35.58,38.3 36.7,37.18 J11.1
  Bottom 0.254: J11.1 36.7,35.59 35.28,34.17 35.28,28.38 34.93,28.03 IC1.27
WATER_LED
  Bottom 0.254: IC1.2 13.42,19.14 9.51,23.05 R18.1
XL1
  Bottom 0.254: IC1.11 23.05,37.7 C13.1 22.85,40.7 Y1.P$1
XL2
  Bottom 0.254: IC1.13 24.32,37.07 C14.1 25.15,40.7 Y1.P$4

### Text on the board
tPlace: SWD SWC | VDD NRST GND | iuiuiu